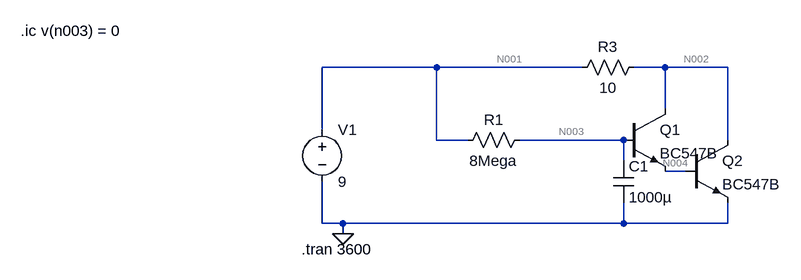
[diagram p0: schematic rctran.asc]
rctran.asc, the LTspice schematic file:
Version 4
SHEET 1 880 680
WIRE -80 -96 -256 -96
WIRE 144 -96 -80 -96
WIRE 272 -96 224 -96
WIRE 368 -96 272 -96
WIRE 272 -32 272 -96
WIRE -256 0 -256 -96
WIRE -80 16 -80 -96
WIRE -32 16 -80 16
WIRE 208 16 48 16
WIRE 368 16 368 -96
WIRE 208 48 208 16
WIRE 304 64 272 64
WIRE -256 144 -256 80
WIRE -224 144 -256 144
WIRE 208 144 208 112
WIRE 208 144 -224 144
WIRE 368 144 368 112
WIRE 368 144 208 144
WIRE -224 160 -224 144
FLAG -224 160 0
SYMBOL voltage -256 -16 R0
SYMATTR InstName V1
SYMATTR Value 9
SYMBOL cap 192 48 R0
SYMATTR InstName C1
SYMATTR Value 1000µ
SYMBOL res 64 0 R90
WINDOW 0 0 56 VBottom 2
WINDOW 3 32 56 VTop 2
SYMATTR InstName R1
SYMATTR Value 8Mega
SYMBOL npn 208 -32 R0
SYMATTR InstName Q1
SYMATTR Value BC547B
SYMBOL npn 304 16 R0
SYMATTR InstName Q2
SYMATTR Value BC547B
SYMBOL res 240 -112 R90
WINDOW 0 0 56 VBottom 2
WINDOW 3 32 56 VTop 2
SYMATTR InstName R3
SYMATTR Value 10
TEXT -288 184 Left 2 !.tran 3600
TEXT -720 -152 Left 2 !.ic v(n003) = 0

The netlist it stands for:
* rctran.asc
V1 N001 0 9
C1 N003 0 1000µ
R1 N003 N001 8Mega
Q1 N002 N003 N004 0 BC547B
Q2 N002 N004 0 0 BC547B
R3 N002 N001 10
.model NPN NPN
.model PNP PNP
.lib standard.bjt
.tran 3600
.ic v(n003) = 0
.backanno
.end

* Results of the author's LTspice run, read from the files saved beside the schematic
* Operating Point, zero values left out:
*   V(n001) = 9 V
*   V(n002) = 9 V
*   V(n004) = 281.9 mV
*   Ic(Q2) = 1.347 nA
*   Ie(Q2) = -1.347 nA
*   Ic(Q1) = 9.07 pA
*   Ib(Q1) = -9.351 pA
*   I(R3) = -1.357 nA
*   I(R1) = -1.125 µA
*   I(V1) = -1.126 µA
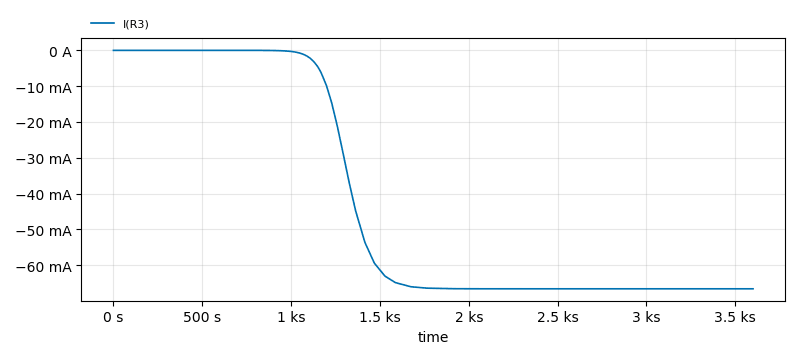
[diagram p1: Transient Analysis of rctran.asc, plotted from the saved traces]
* Transient Analysis, 1 run:
*   I(R3): min -66.61 mA, max 0 A, average -42.19 mA, rms 52.21 mA, last -66.61 mA